# Altium schematic sheet Main.SchDoc: SR4K_PHY6222_SIMPLIFY
size A4; DrawnBy: emmovo@outlook.com; Revision: V1.2; SheetNumber: 1; SheetTotal: 5
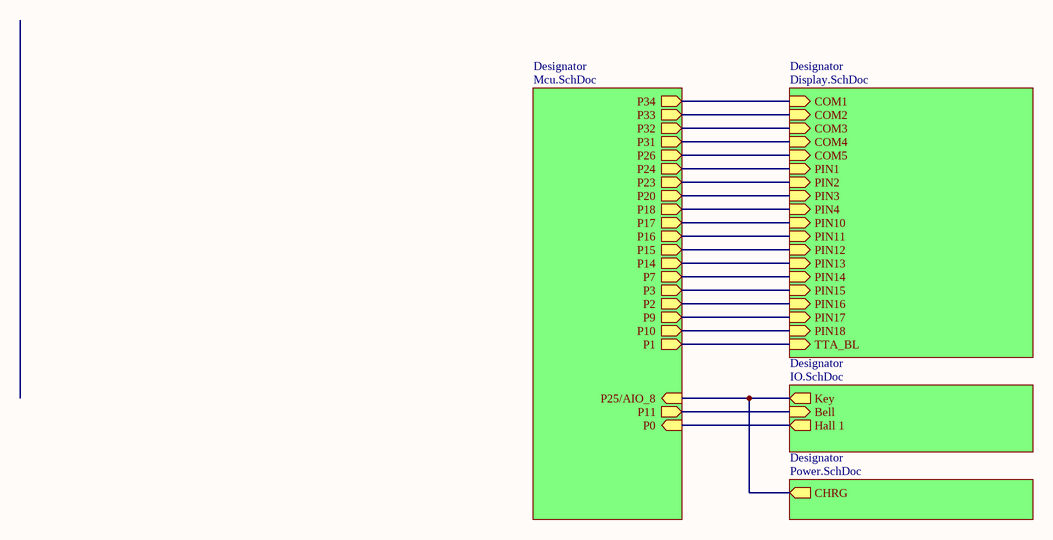
[diagram p0: Main.SchDoc]

## Sub-sheets
Designator = Display.SchDoc: COM1 (in), TTA_BL (in), COM2 (in), COM3 (in), COM4 (in), COM5 (in), PIN1 (in), PIN2 (in), PIN3 (in), PIN4 (in), PIN10 (in), PIN11 (in), PIN12 (in), PIN13 (in), PIN14 (in), PIN15 (in), PIN16 (in), PIN17 (in), PIN18 (in)
Designator = Power.SchDoc: CHRG (out)
Designator = IO.SchDoc: Key (out), Hall 1 (out), Bell (in)
Designator = Mcu.SchDoc: P34 (out), P33 (out), P32 (out), P31 (out), P26 (out), P25/AIO_8 (in), P24 (out), P23 (out), P0 (in), P11 (out), P14 (out), P15 (out), P20 (out), P18 (out), P17 (out), P16 (out), P7 (out), P3 (out), P2 (out), P1 (out), P9 (out), P10 (out)

## Nets
(unnamed): sheet Designator/COM1, sheet Designator/P34
(unnamed): sheet Designator/TTA_BL, sheet Designator/P1
(unnamed): sheet Designator/COM2, sheet Designator/P33
(unnamed): sheet Designator/COM3, sheet Designator/P32
(unnamed): sheet Designator/COM4, sheet Designator/P31
(unnamed): sheet Designator/COM5, sheet Designator/P26
(unnamed): sheet Designator/PIN1, sheet Designator/P24
(unnamed): sheet Designator/PIN2, sheet Designator/P23
(unnamed): sheet Designator/PIN3, sheet Designator/P20
(unnamed): sheet Designator/PIN4, sheet Designator/P18
(unnamed): sheet Designator/PIN10, sheet Designator/P17
(unnamed): sheet Designator/PIN11, sheet Designator/P16
(unnamed): sheet Designator/PIN12, sheet Designator/P15
(unnamed): sheet Designator/PIN13, sheet Designator/P14
(unnamed): sheet Designator/PIN14, sheet Designator/P7
(unnamed): sheet Designator/PIN15, sheet Designator/P3
(unnamed): sheet Designator/PIN16, sheet Designator/P2
(unnamed): sheet Designator/PIN17, sheet Designator/P9
(unnamed): sheet Designator/PIN18, sheet Designator/P10
(unnamed): sheet Designator/CHRG, sheet Designator/Key, sheet Designator/P25/AIO_8
(unnamed): sheet Designator/Hall 1, sheet Designator/P0
(unnamed): sheet Designator/Bell, sheet Designator/P11

## Notes on the sheet
- Title
- Size:
- Date:
- A4
- Number:
- Time:
- Revision:
- Sheet
- emmovo@outlook.com
- of
- File: